# EAGLE schematic hot-wand (EAGLE 7.6.0)
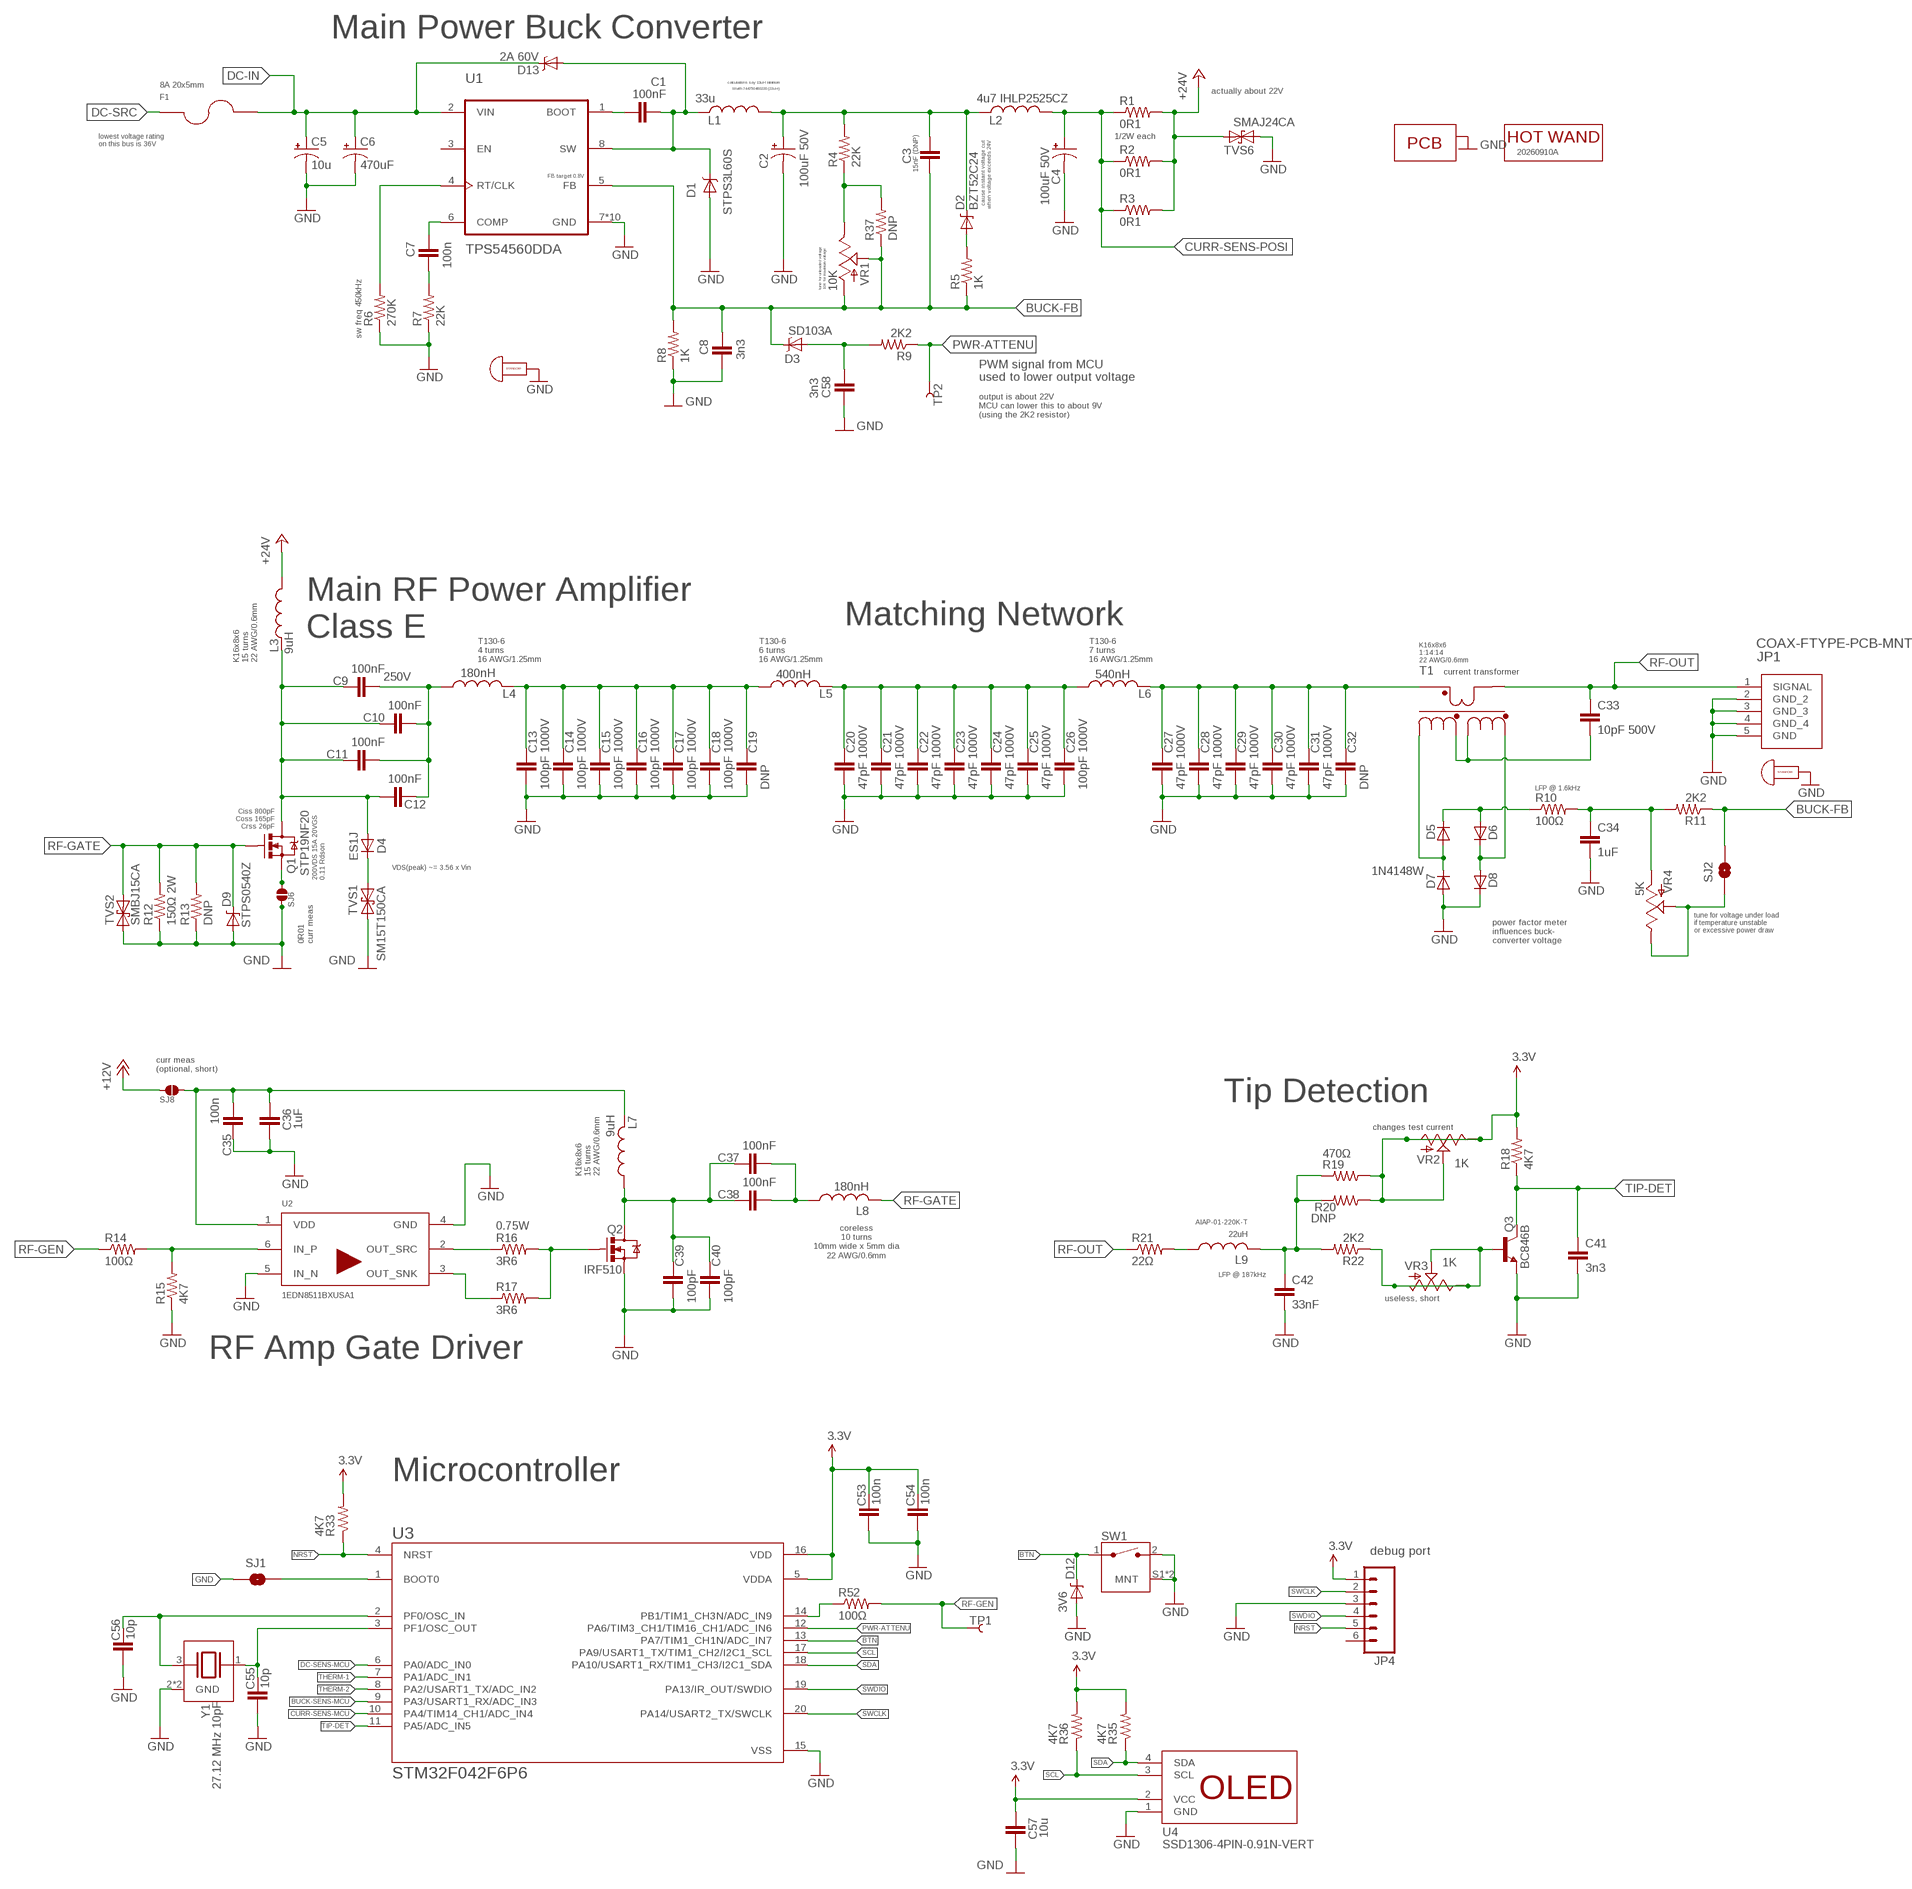
[diagram p0: schematic, sheet 1, part 1 of 2]
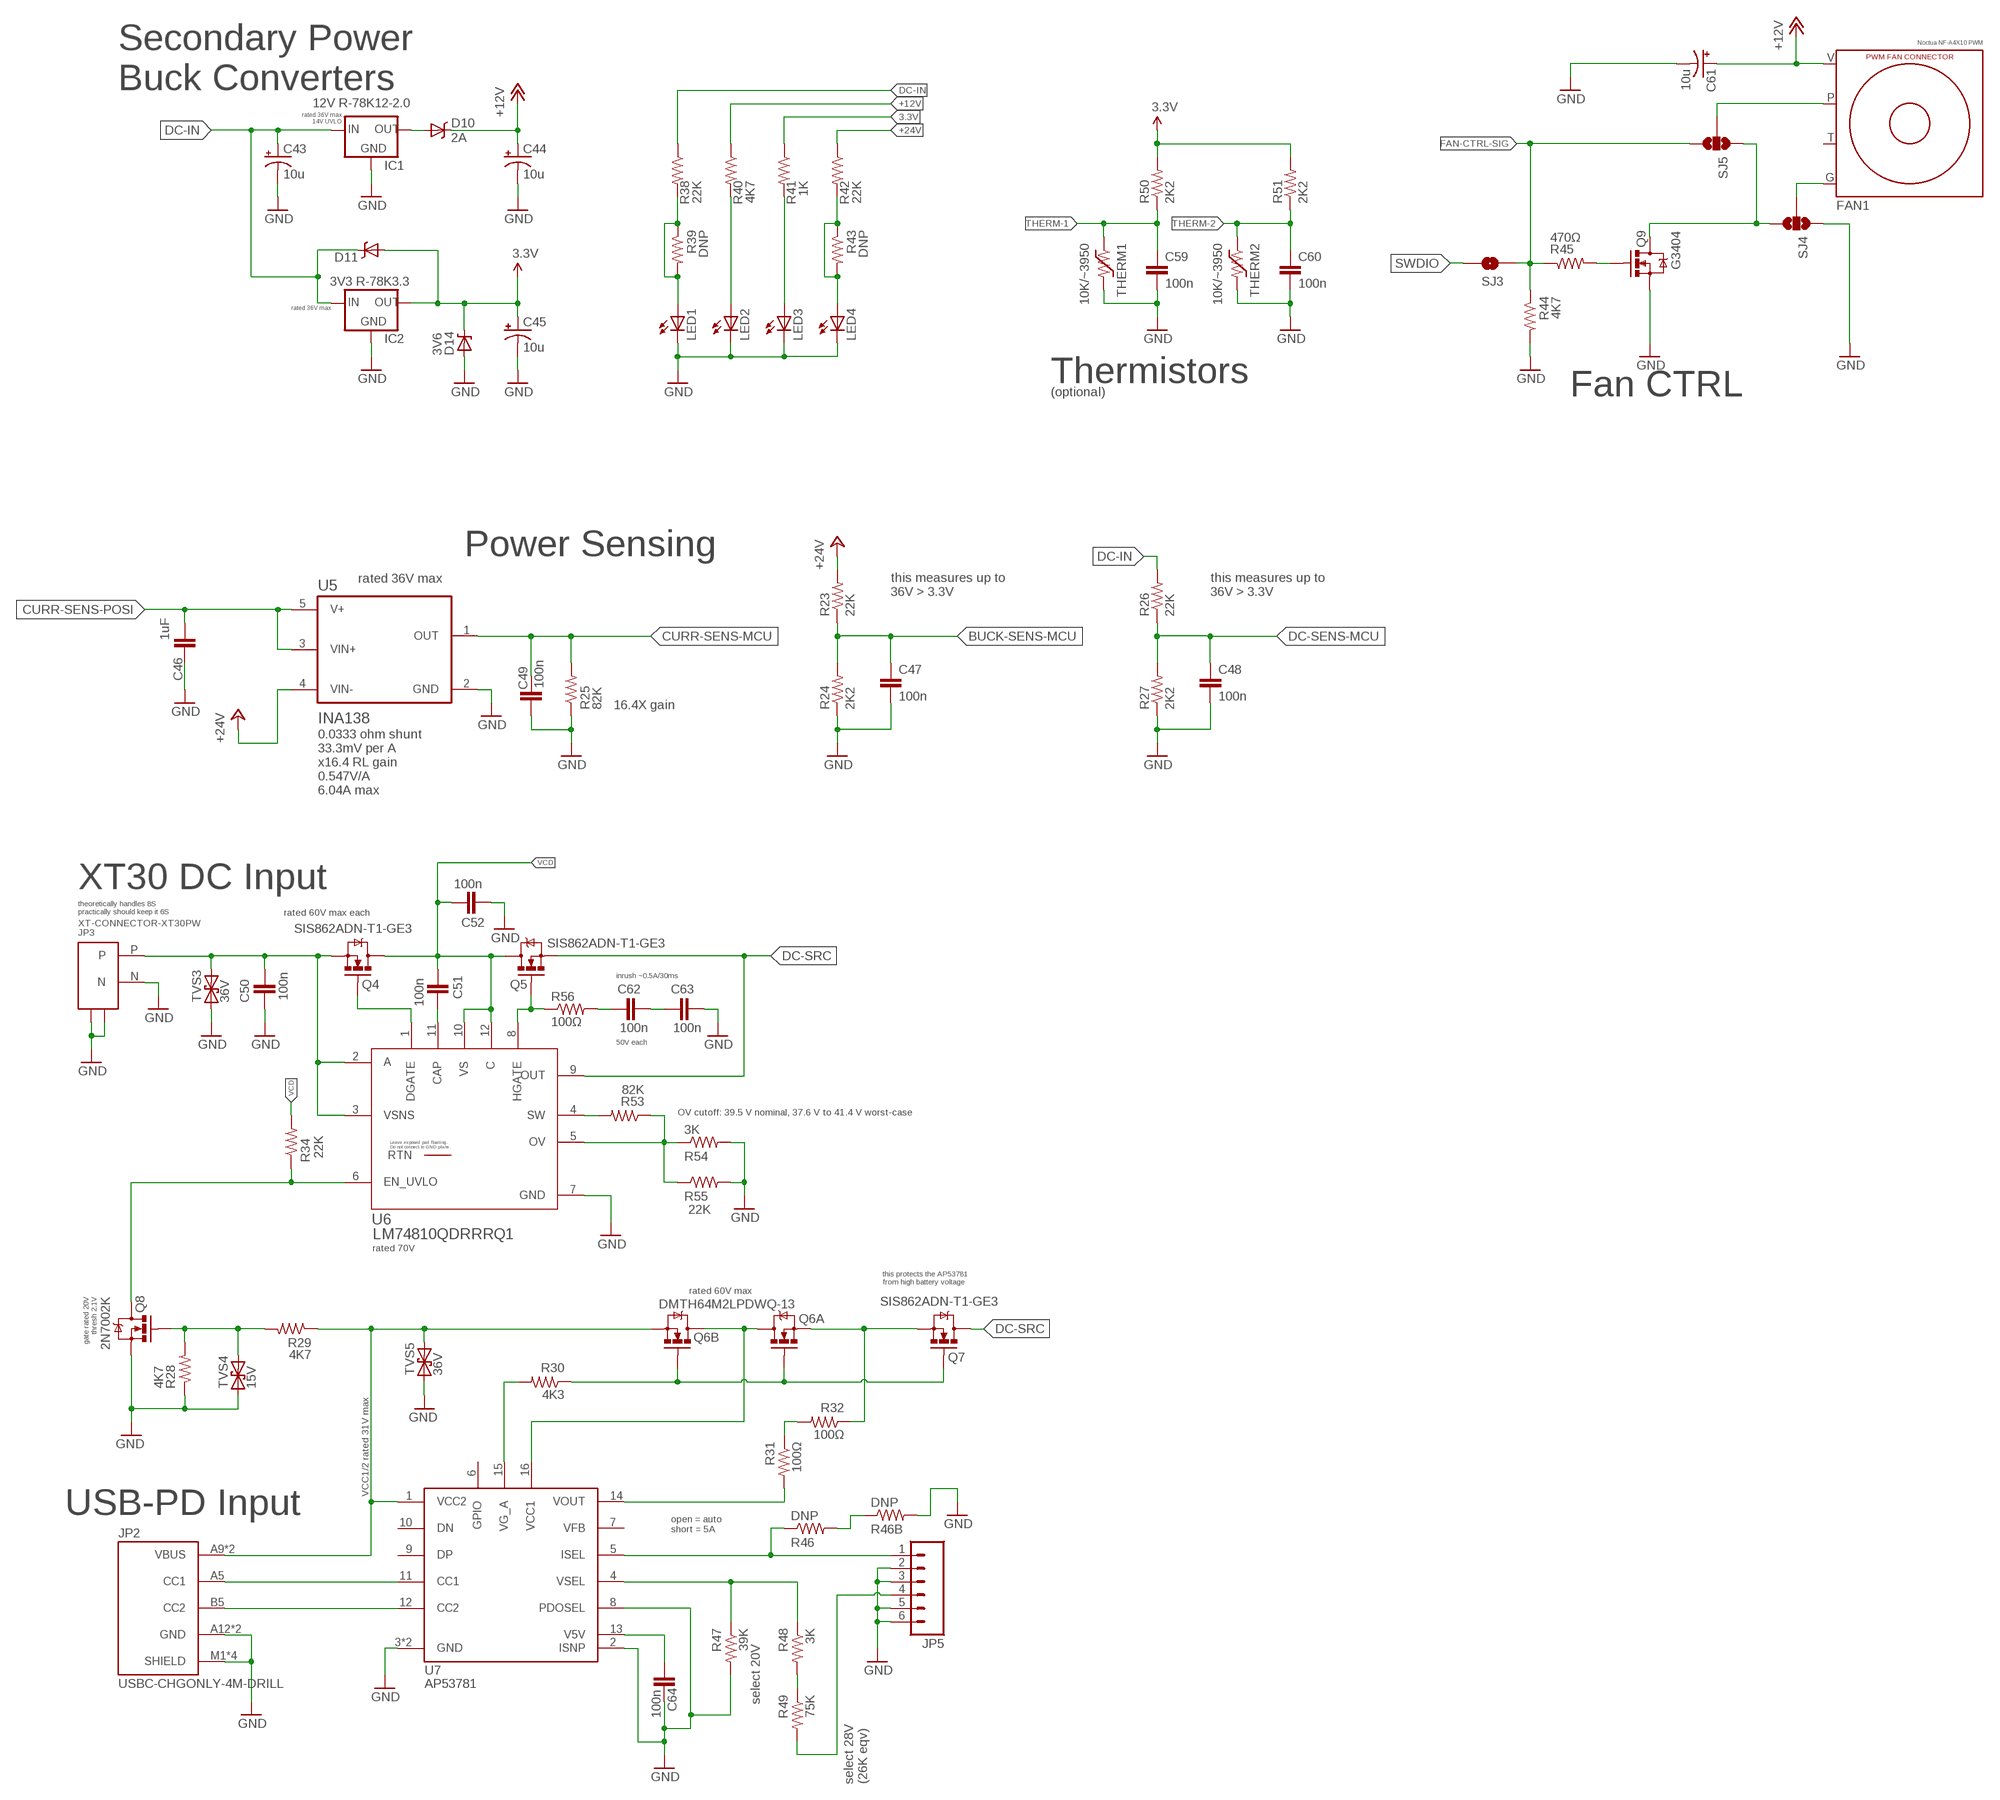
[diagram p1: schematic, sheet 1, part 2 of 2]

## Parts
C1  100nF  CAP0603-CAP  [0603-CAP]
C2  100uF 50V  CAP_POLPTH5  [CPOL-RADIAL-COMBO-10MM]
C3  15nF (DNP)  CAP0805  [0805]
C4  100uF 50V  CAP_POLPTH5  [CPOL-RADIAL-COMBO-10MM]
C5  10u  CAP_POL1206-KIT  [EIA3216-KIT]
C6  470uF  CAP_POLPTH4  [CPOL-RADIAL-1000UF-25V]
C7  100n  CAP0603-CAP  [0603-CAP]
C8  3n3  CAP0603-CAP  [0603-CAP]
C9  100nF  CAP0805-L  [0805-L]
C10  100nF  CAP0805-L  [0805-L]
C11  100nF  CAP0805-L  [0805-L]
C12  100nF  CAP0805-L  [0805-L]
C13  100pF 1000V  CAP0805-L  [0805-L]
C14  100pF 1000V  CAP0805-L  [0805-L]
C15  100pF 1000V  CAP0805-L  [0805-L]
C16  100pF 1000V  CAP0805-L  [0805-L]
C17  100pF 1000V  CAP0805-L  [0805-L]
C18  100pF 1000V  CAP0805-L  [0805-L]
C19  DNP  CAP0805-L  [0805-L]
C20  47pF 1000V  CAP0805-L  [0805-L]
C21  47pF 1000V  CAP0805-L  [0805-L]
C22  47pF 1000V  CAP0805-L  [0805-L]
C23  47pF 1000V  CAP0805-L  [0805-L]
C24  47pF 1000V  CAP0805-L  [0805-L]
C25  47pF 1000V  CAP0805-L  [0805-L]
C26  100pF 1000V  CAP0805-L  [0805-L]
C27  47pF 1000V  CAP0805-L  [0805-L]
C28  47pF 1000V  CAP0805-L  [0805-L]
C29  47pF 1000V  CAP0805-L  [0805-L]
C30  47pF 1000V  CAP0805-L  [0805-L]
C31  47pF 1000V  CAP0805-L  [0805-L]
C32  DNP  CAP0805-L  [0805-L]
C33  10pF 500V  CAP0805-L  [0805-L]
C34  1uF  CAP0603-CAP  [0603-CAP]
C35  100n  CAP0603-CAP  [0603-CAP]
C36  1uF  CAP0603-CAP  [0603-CAP]
C37  100nF  CAP0805-L  [0805-L]
C38  100nF  CAP0805-L  [0805-L]
C39  100pF  CAP0805-L  [0805-L]
C40  100pF  CAP0805-L  [0805-L]
C41  3n3  CAP0603-CAP  [0603-CAP]
C42  33nF  CAP0603-CAP  [0603-CAP]
C43  10u  CAP_POL1206-KIT  [EIA3216-KIT]
C44  10u  CAP_POL1206-KIT  [EIA3216-KIT]
C45  10u  CAP_POL1206  [EIA3216]
C46  1uF  CAP0603-CAP  [0603-CAP]
C47  100n  CAP0603-CAP  [0603-CAP]
C48  100n  CAP0603-CAP  [0603-CAP]
C49  100n  CAP0603-CAP  [0603-CAP]
C50  100n  CAP0603-CAP  [0603-CAP]
C51  100n  CAP0603-CAP  [0603-CAP]
C52  100n  CAP0603-CAP  [0603-CAP]
C53  100n  CAP0603-CAP  [0603-CAP]
C54  100n  CAP0603-CAP  [0603-CAP]
C55  10p  CAP0603-CAP  [0603-CAP]
C56  10p  CAP0603-CAP  [0603-CAP]
C57  10u  CAP1206  [1206]
C58  3n3  CAP0603-CAP  [0603-CAP]
C59  100n  CAP0603-CAP  [0603-CAP]
C60  100n  CAP0603-CAP  [0603-CAP]
C61  10u  CAP_POL1206-KIT  [EIA3216-KIT]
C62  100n  CAP0603-CAP  [0603-CAP]
C63  100n  CAP0603-CAP  [0603-CAP]
C64  100n  CAP0603-CAP  [0603-CAP]
D1  STPS3L60S  DIODE-SCHOTTKYSMC  [SMC]
D2  BZT52C24  DIODE-ZENERSOD123FL  [SOD123FL]
D3  SD103A  DIODE-SCHOTTKYSOD-323  [SOD-323]
D4  ES1J  DIODESMA  [SMA-DIODE]
D5  4148  DIODESOD123FL  [SOD123FL]
D6  4148  DIODESOD123FL  [SOD123FL]
D7  1N4148W  DIODESOD123FL  [SOD123FL]
D8  4148  DIODESOD123FL  [SOD123FL]
D9  STPS0540Z  DIODE-ZENERSOD123FL  [SOD123FL]
D10  2A  DIODE-SCHOTTKY_  [SMA-DIODE]
D11  DIODE-SCHOTTKY_  [SMA-DIODE]
D12  3V6  DIODE-ZENER-BZT52  [SOD-323]
D13  2A 60V  DIODE-SCHOTTKYSOD123FL  [SOD123FL]
D14  3V6  DIODE-ZENER-BZT52  [SOD-323]
F1  8A 20x5mm  FUSEX20MM  [FUSE_5MM]
FAN1  FAN-CONN-X4-CONN-X4  [FAN-CONN-X4]
IC1  12V R-78K12-2.0  V_REG_78XX-BUCK  [TO220-BUCK-12V]
IC2  3V3 R-78K3.3  V_REG_78XX-BUCK-3.3V  [TO220-BUCK-3.3V]
JP1  COAX-FTYPE-PCB-MNT  [CONN_73330-0030_MOL]
JP2  USBC-CHGONLY-4M-DRILL  [SAMESKY_UJC-H-G-SMT-2-P6-TR-DRILL]
JP3  XT-CONNECTOR-XT30PW  [XT30PW]
JP4  M06LOCK  [1X06_LOCK]
JP5  M06LOCK  [1X06_LOCK]
L1  33u  INDUCTORRADIAL_D12.7_COMBO  [IND_RADIAL_D12.7_COMBO]
L2  4u7 IHLP2525CZ  INDUCTORIHLP-2525CZ_VIS-M  [IND_IHLP-2525CZ_VIS-M]
L3  9uH  INDUCTOR-K16X8X6  [IND_K16X8X6_X2]
L4  180nH  INDUCTOR-T130-6  [IND_T130-6_X2]
L5  400nH  INDUCTOR-T130-6  [IND_T130-6_X2]
L6  540nH  INDUCTOR-T130-6  [IND_T130-6_X2]
L7  9uH  INDUCTOR-K16X8X6  [IND_K16X8X6_X2]
L8  180nH  L-USIND-10X6MM  [IND-10X6MM]
L9  22uH  L-USTFI0410  [TFI0410]
LED1  LED  LED0603  [LED-0603]
LED2  LED  LED0603  [LED-0603]
LED3  LED  LED0603  [LED-0603]
LED4  LED  LED0603  [LED-0603]
PCB1  PCB-OUTLINE  [PCB-OUTLINE]
PCB2  PCB-ART-VERSION  [PCB-ART-VERSION]
Q1  STP19NF20  MOSFET-NCHANNEL-TO220V-REAR  [TO220V-REAR]
Q2  IRF510  MOSFET-NCHANNEL-TO220V-REAR  [TO220V-REAR]
Q3  BC846B  TRANSISTOR_NPNSOT23-3  [SOT23-3]
Q4  SIS862ADN-T1-GE3  MOSFET-NCHANNEL-POWERPAK1212-8  [POWERPAK-1212-8]
Q5  SIS862ADN-T1-GE3  MOSFET-NCHANNEL-POWERPAK1212-8  [POWERPAK-1212-8]
Q6  DMTH64M2LPDWQ-13  MOSFET-NCHAN-X2-PPSO8X2  [POWERPAK-SO8-X2]
Q7  SIS862ADN-T1-GE3  MOSFET-NCHANNEL-POWERPAK1212-8  [POWERPAK-1212-8]
Q8  2N7002K  MOSFET-NCHANNELSMD  [SOT23-3]
Q9  G3404  MOSFET-NCHANNELSMD  [SOT23-3]
R1  0R1  RESISTOR1206  [1206]
R2  0R1  RESISTOR1206  [1206]
R3  0R1  RESISTOR1206  [1206]
R4  22K  RESISTOR0603-RES  [0603-RES]
R5  1K  RESISTOR0603-RES  [0603-RES]
R6  270K  RESISTOR0603-RES  [0603-RES]
R7  22K  RESISTOR0603-RES  [0603-RES]
R8  1K  RESISTOR0603-RES  [0603-RES]
R9  2K2  RESISTOR0603-RES  [0603-RES]
R10  100Ω  RESISTOR0603-RES  [0603-RES]
R11  2K2  RESISTOR0603-RES  [0603-RES]
R12  150Ω 2W  R-US_R2512  [R2512]
R13  DNP  R-US_R2512  [R2512]
R14  100Ω  RESISTOR0603-RES  [0603-RES]
R15  4K7  RESISTOR0603-RES  [0603-RES]
R16  3R6  RESISTOR1206  [1206]
R17  3R6  RESISTOR1206  [1206]
R18  4K7  RESISTOR0603-RES  [0603-RES]
R19  470Ω  RESISTOR0603-RES  [0603-RES]
R20  DNP  RESISTOR0805-RES  [0805]
R21  22Ω  RESISTOR2512  [R2512]
R22  2K2  RESISTOR0603-RES  [0603-RES]
R23  22K  RESISTOR0603-RES  [0603-RES]
R24  2K2  RESISTOR0603-RES  [0603-RES]
R25  82K  RESISTOR0603-RES  [0603-RES]
R26  22K  RESISTOR0603-RES  [0603-RES]
R27  2K2  RESISTOR0603-RES  [0603-RES]
R28  4K7  RESISTOR0603-RES  [0603-RES]
R29  4K7  RESISTOR0603-RES  [0603-RES]
R30  4K3  RESISTOR0603-RES  [0603-RES]
R31  100Ω  RESISTOR0805-RES  [0805]
R32  100Ω  RESISTOR0805-RES  [0805]
R33  4K7  RESISTOR0603-RES  [0603-RES]
R34  22K  RESISTOR0603-RES  [0603-RES]
R35  4K7  RESISTOR0603-RES  [0603-RES]
R36  4K7  RESISTOR0603-RES  [0603-RES]
R37  DNP  RESISTOR0603-RES  [0603-RES]
R38  22K  RESISTOR0603-RES  [0603-RES]
R39  DNP  RESISTOR0603-RES  [0603-RES]
R40  4K7  RESISTOR0603-RES  [0603-RES]
R41  1K  RESISTOR0603-RES  [0603-RES]
R42  22K  RESISTOR0603-RES  [0603-RES]
R43  DNP  RESISTOR0603-RES  [0603-RES]
R44  4K7  RESISTOR0603-RES  [0603-RES]
R45  470Ω  RESISTOR0603-RES  [0603-RES]
R46  DNP  RESISTOR0603-RES  [0603-RES]
R46B  DNP  RESISTOR0603-RES  [0603-RES]
R47  39K  RESISTOR0603-RES  [0603-RES]
R48  3K  RESISTOR0603-RES  [0603-RES]
R49  75K  RESISTOR0603-RES  [0603-RES]
R50  2K2  RESISTOR0603-RES  [0603-RES]
R51  2K2  RESISTOR0603-RES  [0603-RES]
R52  100Ω  RESISTOR0603-RES  [0603-RES]
R53  82K  RESISTOR0603-RES  [0603-RES]
R54  3K  RESISTOR0603-RES  [0603-RES]
R55  22K  RESISTOR0603-RES  [0603-RES]
R56  100Ω  RESISTOR0805-RES  [0805]
SJ1  SOLDERJUMPERNO  [SJ_2S-NO]
SJ2  SOLDERJUMPERNO  [SJ_2S-NO]
SJ3  SOLDERJUMPERNO  [SJ_2S-NO]
SJ4  SOLDERJUMPER_2WAYS  [SJ_3]
SJ5  SOLDERJUMPER_2WAYS  [SJ_3]
SJ6  SJ-SMALL-1206-SJ  [1206-SJ]
SJ7  SJ-SMALL-1206-SJ  [1206-SJ]
SJ8  SJ-SMALL-1206-SJ  [1206-SJ]
STANDOFF1  STANDOFF-M2.5-4.5MMHEX  [STANDOFF-M2.5-4.5MMHEX]
STANDOFF2  STANDOFF-M2.5-4.5MMHEX  [STANDOFF-M2.5-4.5MMHEX]
SW1  SW-TACT-SIDE  [SW_1-1825027-1]
T1  XFORMER-1:14:14  [XFORMER-K16X8X6-1:14:14]
THERM1  10K/~3950  THERMISTOR-NTC-TH-2MM  [1X02-2MM]
THERM2  10K/~3950  THERMISTOR-NTC-TH-2MM  [1X02-2MM]
TP1  TEST-POINT-SQ-2MM  [PAD-SQ-2MM]
TP2  TEST-POINT-SQ-2MM  [PAD-SQ-2MM]
TVS1  SM15T150CA  TVSSMC  [SMC]
TVS2  SMBJ15CA  TVS  [SMA-DIODE]
TVS3  36V  TVSSMA  [SMA]
TVS4  15V  TVSSOD-323  [SOD-323]
TVS5  36V  TVSSMA  [SMA]
TVS6  SMAJ24CA  TVSSMA  [SMA]
U1  TPS54560DDA  [VREG_LM5017MR/NOPB]
U2  1EDN8511BXUSA1  1EDN8511B  [SOT95P280X145-6N-7-V]
U3  STM32F042F6P6  STM32F030F4P6  [SOP65P640X120-20N]
U4  SSD1306-4PIN-0.91N-VERT  OLED-SSD1306-4PIN-0.91N-VERT  [OLED-0.91IN-VERT]
U5  INA138  INA138NA/3K  [SOT95P280X145-5N]
U6  LM74810QDRRRQ1  [DRR0012E-MFG]
U7  AP53781  AP53781-QFN3030-16  [QFN3030-16]
VR1  10K  POT-35WR1KLFTR_V2  [TRIM_35WR1KLFTR_V2]
VR2  1K  POT-35WR1KLFTR_V3  [TRIM_35WR1KLFTR_V3]
VR3  1K  POT-35WR1KLFTR_V3  [TRIM_35WR1KLFTR_V3]
VR4  5K  POT-35WR1KLFTR_V2  [TRIM_35WR1KLFTR_V2]
Y1  27.12 MHz 10pF  XTAL-4SMD-3.2X2.5-V2  [XTAL-4SMD-3.2X2.5-V2]

## Nets
3.3V: C45.A(+) C53.1 C54.1 C57.2 D11.A D14.1(C) IC2.3(OUT) JP4.1 R18.2 R19.1 R20.1 R33.2 R35.2 R36.2 R41.1 R50.2 R51.2 U3.5(VDDA) U3.16(VDD) U4.2(VCC) VR2.1(A) VR2.2(S) VR2.3(E)
12V-2: D10.A IC1.3(OUT)
12V-FOR-GATE-DRIVER: C35.2 C36.2 L7.2 SJ8.2 U2.1(VDD)
+12V: C44.A(+) C61.A(+) D10.C FAN1.V R40.1 SJ8.1
+24V: L3.2 R1.2 R2.2 R3.2 R23.2 R42.1 TVS6.C U5.4(VIN-)
BTN: D12.1(C) SW1.1 U3.13(PA7/TIM1_CH1N/ADC_IN7)
BUCK-1ST-STAGE: C2.1(+) C2.1B(+) C3.2 D2.C L1.2 L1.2B L2.1 R4.2
BUCK-FB: C3.1 C8.2 D3.1(C) R5.1 R8.2 R11.1 R37.1 SJ2.2 U1.5(FB) VR1.1(A) VR1.2(S)
BUCK-SENS-MCU: C47.1 R23.1 R24.2 U3.9(PA3/USART1_RX/ADC_IN3)
BUCK-SWITCH-NODE: C1.2 D1.C D13.A L1.1 L1.1B U1.8(SW)
CURR-SENS-MCU: C49.1 R25.2 U3.10(PA4/TIM14_CH1/ADC_IN4) U5.1(OUT)
CURR-SENS-POSI: C4.1(+) C4.1B(+) C46.2 L2.2 R1.1 R2.1 R3.1 U5.3(VIN+) U5.5(V+)
DC-IN: C5.A(+) C6.1(+) C43.A(+) D11.C D13.C F1.3 F1.4 IC1.1(IN) IC2.1(IN) R26.2 R38.1 U1.2(VIN)
DC-SENS-MCU: C48.1 R26.1 R27.2 U3.6(PA0/ADC_IN0)
DC-SRC: F1.1 F1.2 Q5.1(S) Q5.2(S) Q5.3(S) Q7.5(D) Q7.6(D) Q7.7(D) Q7.8(D) Q7.9(D) U6.9(OUT)
FAN-CTRL-SIG: R44.1 R45.1 SJ3.1 SJ5.3
GND: C2.2(-) C2.2B(-) C4.2(-) C4.2B(-) C5.C(-) C6.2(-) C8.1 C13.2 C14.2 C15.2 C16.2 C17.2 C18.2 C19.2 C20.2 C21.2 C22.2 C23.2 C24.2 C25.2 C26.2 C27.2 C28.2 C29.2 C30.2 C31.2 C32.2 C34.2 C35.1 C36.1 C39.2 C40.2 C41.2 C42.2 C43.C(-) C44.C(-) C45.C(-) C46.1 C47.2 C48.2 C49.2 C50.2 C52.2 C53.2 C54.2 C55.2 C56.2 C57.1 C58.1 C59.2 C60.2 C61.C(-) C63.1 C64.1 D1.A D7.A D8.C D9.A D12.2(A) D14.2(A) IC1.2(GND) IC2.2(GND) JP1.2(GND_2) JP1.3(GND_3) JP1.4(GND_4) JP1.5(GND) JP2.A12(GND) JP2.B12(GND) JP2.M1(SHIELD) JP2.M2(SHIELD) JP2.M3(SHIELD) JP2.M4(SHIELD) JP3.M1 JP3.M2 JP3.N JP4.3 JP5.2 JP5.3 JP5.5 JP5.6 LED1.C LED2.C LED3.C LED4.C PCB1.1 PCB1.2 PCB1.3 PCB1.4 Q2.3(S) Q3.2(E) Q8.2(S) Q9.2(S) R6.1 R7.1 R8.1 R12.1 R13.1 R15.1 R24.1 R25.1 R27.1 R28.1 R44.2 R46B.2 R47.2 R54.2 R55.2 SJ1.1 SJ4.1 SJ6.1 SJ7.1 STANDOFF1.1 STANDOFF1.2 STANDOFF2.1 STANDOFF2.2 SW1.2 SW1.S1(MNT) SW1.S2(MNT) THERM1.2 THERM2.2 TVS1.A TVS2.A TVS3.A TVS4.2 TVS5.A TVS6.A U1.7(GND) U1.9(GND) U1.10(GND) U1.11(GND) U1.12(GND) U1.13(GND) U1.14(GND) U1.15(GND) U1.16(GND) U1.17(GND) U2.4(GND) U2.5(IN_N) U3.15(VSS) U4.1(GND) U5.2(GND) U6.7(GND) U7.2(ISNP) U7.3(GND) U7.8(PDOSEL) U7.EXP(GND) Y1.2(GND) Y1.4(GND)
MCU-BOOT0: SJ1.2 U3.1(BOOT0)
MCU-OSC-IN: C56.1 U3.2(PF0/OSC_IN) Y1.3
MCU-OSC-OUT: C55.1 U3.3(PF1/OSC_OUT) Y1.1
MCU-RF: R14.2 R15.2 U2.6(IN_P)
N$1: L9.1 R21.2
N$2: C33.2 T1.S1B T1.S2A
N$3: C20.1 C21.1 C22.1 C23.1 C24.1 C25.1 C26.1 L5.2 L6.1
N$4: D5.C D6.A R10.1
N$5: D6.C D8.A T1.S2B
N$6: D5.A D7.C T1.S1A
N$7: D4.C TVS1.C
N$9: C42.1 L9.2 R19.2 R20.2 R22.2
N$10: C13.1 C14.1 C15.1 C16.1 C17.1 C18.1 C19.1 L4.2 L5.1
N$11: C9.2 C10.2 C11.2 C12.2 L4.1
N$14: R16.1 U2.2(OUT_SRC)
N$15: R17.1 U2.3(OUT_SNK)
N$16: Q2.1(G) R16.2 R17.2
N$17: C37.2 C38.2 L8.1
N$19: C7.2 U1.6(COMP)
N$20: C7.1 R7.2
N$21: R6.2 U1.4(RT/CLK)
N$22: C1.1 U1.1(BOOT)
N$25: R4.1 R37.2 VR1.3(E)
N$27: D2.A R5.2
N$28: C58.2 D3.2(A) R9.2
N$29: C62.1 C63.2
N$30: Q8.1(G) R28.2 R29.2 TVS4.1
N$35: Q6.5(B:D) Q6.6(B:D) Q6.7(A:D) Q6.8(A:D) Q6.9(B:D) Q6.10(A:D) U7.16(VCC1)
N$38: C64.2 U7.13(V5V)
N$40: R31.2 U7.14(VOUT)
N$43: C62.2 R56.2
N$47: LED2.A R40.2
N$48: LED3.A R41.2
N$49: LED1.A R38.2 R39.1 R39.2
N$50: SJ2.1 VR4.2(S) VR4.3(E)
N$53: Q9.1(G) R45.2
N$55: R46.2 R46B.1
N$57: R31.1 R32.2
N$60: R48.2 R49.1
N$61: JP5.4 R49.2
N$62: LED4.A R42.2 R43.1 R43.2
N$63: Q6.1(A:S) Q7.1(S) Q7.2(S) Q7.3(S) R32.1
N$65: FAN1.G SJ4.2
N$67: FAN1.P SJ5.2
N$68: R53.2 U6.4(SW)
NRST: JP4.5 R33.1 U3.4(NRST)
PWR-ATTENU: R9.1 TP2.1 U3.12(PA6/TIM3_CH1/TIM16_CH1/ADC_IN6)
Q1-VD: C9.1 C10.1 C11.1 C12.1 D4.A L3.1 Q1.2(D)
Q1-VS: Q1.3(S) SJ6.2 SJ7.2
Q2-VD: C37.1 C38.1 C39.1 C40.1 L7.1 Q2.2(D)
Q3-VB: Q3.1(B) R22.1 VR3.1(A) VR3.2(S) VR3.3(E)
Q9-VD: Q9.3(D) SJ4.3 SJ5.1
RF-FB-RECTIFIED: C34.1 R10.2 R11.2 VR4.1(A)
RF-FINAL: C27.1 C28.1 C29.1 C30.1 C31.1 C32.1 L6.2 T1.P1(P2)
RF-GATE: D9.C L8.2 Q1.1(G) R12.2 R13.2 TVS2.C
RF-GEN: R14.1 R52.2 TP1.1
RF-GEN-: R52.1 U3.14(PB1/TIM1_CH3N/ADC_IN9)
RF-OUT: C33.1 JP1.1(SIGNAL) R21.1 T1.P2(P1)
SCL: R36.1 U3.17(PA9/USART1_TX/TIM1_CH2/I2C1_SCL) U4.3(SCL)
SDA: R35.1 U3.18(PA10/USART1_RX/TIM1_CH3/I2C1_SDA) U4.4(SDA)
SWCLK: JP4.2 U3.20(PA14/USART2_TX/SWCLK)
SWDIO: JP4.4 SJ3.2 U3.19(PA13/IR_OUT/SWDIO)
THERM-1: C59.1 R50.1 THERM1.1 U3.7(PA1/ADC_IN1)
THERM-2: C60.1 R51.1 THERM2.1 U3.8(PA2/USART1_TX/ADC_IN2)
TIP-DET: C41.1 Q3.3(C) R18.1 U3.11(PA5/ADC_IN5)
U6-CAP: C51.1 U6.11(CAP)
U6-DGATE: Q4.4(G) U6.1(DGATE)
U6-EN: Q8.3(D) R34.1 U6.6(EN_UVLO)
U6-HGATE: Q5.4(G) R56.1 U6.8(HGATE)
U6-OV: R53.1 R54.1 R55.1 U6.5(OV)
U7-ISEL: JP5.1 R46.1 U7.5(ISEL)
U7-VGA: R30.2 U7.15(VG_A)
U7-VGA-2: Q6.2(A:G) Q6.4(B:G) Q7.4(G) R30.1
U7-VSEL: R47.1 R48.1 U7.4(VSEL)
USB-CC1: JP2.A5(CC1) U7.11(CC1)
USB-CC2: JP2.B5(CC2) U7.12(CC2)
USB-VBUS: JP2.A9(VBUS) JP2.B9(VBUS) Q6.3(B:S) R29.1 TVS5.C U7.1(VCC2)
VCD: C51.2 C52.1 Q4.5(D) Q4.6(D) Q4.7(D) Q4.8(D) Q4.9(D) Q5.5(D) Q5.6(D) Q5.7(D) Q5.8(D) Q5.9(D) R34.2 U6.10(VS) U6.12(C)
VIN-XT30: C50.1 JP3.P Q4.1(S) Q4.2(S) Q4.3(S) TVS3.C U6.2(A) U6.3(VSNS)
Unconnected: FAN1.T JP4.6 U1.3(EN) U6.13(RTN) U7.6(GPIO) U7.7(VFB) U7.9(DP) U7.10(DN)

## Notes on the sheet
- Main Power Buck Converter
- calculations say 13uH minimum
- actually about 22V
- Wurth 744750460220 (22uH)
- 1/2W each
- cause instant voltage cut
  when voltage exceeds 24V
- lowest voltage rating
  on this bus is 36V
- FB target 0.8V
- tune for unloaded voltage
  10K for maximum voltage
- sw freq 450kHz
- PWM signal from MCU
  used to lower output voltage
- output is about 22V
  MCU can lower this to about 9V
  (using the 2K2 resistor)
- Main RF Power Amplifier
  Class E
- Matching Network
- K16x8x6
  15 turns
  22 AWG/0.6mm
- T130-6
  4 turns
  16 AWG/1.25mm
- T130-6
  6 turns
  16 AWG/1.25mm
- T130-6
  7 turns
  16 AWG/1.25mm
- K16x8x6
  1:14:14
  22 AWG/0.6mm
- current transformer
- 250V
- LFP @ 1.6kHz
- Ciss 800pF
  Coss 165pF
  Crss 26pF
- VDS(peak) ~= 3.56 x Vin
- 200VDS 15A 20VGS
  0.11 Rdson
- tune for voltage under load
  if temperature unstable
  or excessive power draw
- power factor meter
  influences buck-
  converter voltage
- 0R01
  curr meas
- curr meas
  (optional, short)
- Tip Detection
- changes test current
- K16x8x6
  15 turns
  22 AWG/0.6mm
- coreless
  10 turns
  10mm wide x 5mm dia
  22 AWG/0.6mm
- AIAP-01-220K-T
- 0.75W
- LFP @ 187kHz
- useless, short
- RF Amp Gate Driver
- Microcontroller
- debug port
- Noctua NF-A4X10 PWM
- Secondary Power
  Buck Converters
- rated 36V max
  14V UVLO
- rated 36V max
- Thermistors
- (optional) | Fan CTRL
- Power Sensing
- rated 36V max
- this measures up to
  36V > 3.3V
- this measures up to
  36V > 3.3V
- 16.4X gain
- 0.0333 ohm shunt
  33.3mV per A
  x16.4 RL gain
  0.547V/A
  6.04A max
- XT30 DC Input
- theoretically handles 8S
  practically should keep it 6S
- rated 60V max each
- inrush ~0.5A/30ms
- 50V each
- OV cutoff: 39.5 V nominal, 37.6 V to 41.4 V worst-case
- rated 70V
- this protects the AP53781
  from high battery voltage
- rated 60V max
- gate rated 20V
  thresh 2.1V
- VCC1/2 rated 31V max
- USB-PD Input
- open = auto
  short = 5A
- select 20V
- select 28V
  (26K eqv)

## Library data of the parts
C1 C7 C35 C48-C54 C59 C60 C62-C64 = hot-wand:CAP: Capacitor Standard 0603 ceramic capacitor, and 0.1" leaded capacitor.; JLCPARTNUM: C14663
C2 = hot-wand:CAP_POL: Capacitor Polarized These are standard SMD and PTH capacitors. Normally 10uF, 47uF, and 100uF in electrolytic and tantalum varieties. Always verify the external diameter of the through hole cap, it varies with capacity, voltage, and manufacturer. The EIA devices should be standard.; JLC-DNP: 1; PARTNUM: EEU-FR1H101B;EEU-FR1J101B
C3 = hot-wand:CAP: Capacitor Standard 0603 ceramic capacitor, and 0.1" leaded capacitor.; DNP: 1; JLC-DNP: 1
C4 = hot-wand:CAP_POL: Capacitor Polarized These are standard SMD and PTH capacitors. Normally 10uF, 47uF, and 100uF in electrolytic and tantalum varieties. Always verify the external diameter of the through hole cap, it varies with capacity, voltage, and manufacturer. The EIA devices should be standard.; JLC-DNP: 1
C5 C43 C61 = hot-wand:CAP_POL: Capacitor Polarized These are standard SMD and PTH capacitors. Normally 10uF, 47uF, and 100uF in electrolytic and tantalum varieties. Always verify the external diameter of the through hole cap, it varies with capacity, voltage, and manufacturer. The EIA devices should be standard.; JLCPARTNUM: C13585; PARTNUM: MLASU31LBB5106KTNA01;GRT31CR61H106KE01K
C6 = hot-wand:CAP_POL: Capacitor Polarized These are standard SMD and PTH capacitors. Normally 10uF, 47uF, and 100uF in electrolytic and tantalum varieties. Always verify the external diameter of the through hole cap, it varies with capacity, voltage, and manufacturer. The EIA devices should be standard.; JLC-DNP: 1; PARTNUM: UHW1H471MPD;EEU-FR1H471;EEU-FR1H471B
C8 C41 C58 = hot-wand:CAP: Capacitor Standard 0603 ceramic capacitor, and 0.1" leaded capacitor.; JLCPARTNUM: C1613
C9-C12 C37 C38 = hot-wand:CAP: Capacitor Standard 0603 ceramic capacitor, and 0.1" leaded capacitor.; JLCPARTNUM: C5182461; PARTNUM: CHV0805N250104KXT;MBASQ21GAB7104KTCA01;MBASQ21GAB7104MTCA01
C13 = hot-wand:CAP: Capacitor Standard 0603 ceramic capacitor, and 0.1" leaded capacitor.; JLCPARTNUM: C6958299; PARTNUM: QCCT102Q101J1GV001E; PLACEHOLDERPART: C28233
C14-C18 C26 C39 C40 = hot-wand:CAP: Capacitor Standard 0603 ceramic capacitor, and 0.1" leaded capacitor.; JLCPARTNUM: C6958299
C19 = hot-wand:CAP: Capacitor Standard 0603 ceramic capacitor, and 0.1" leaded capacitor.; DNP: 1; JLCPARTNUM: C6958299
C20 = hot-wand:CAP: Capacitor Standard 0603 ceramic capacitor, and 0.1" leaded capacitor.; JLCPARTNUM: C6366545; PARTNUM: QCCT102Q470J1GV001E
C21-C25 C27-C31 = hot-wand:CAP: Capacitor Standard 0603 ceramic capacitor, and 0.1" leaded capacitor.; JLCPARTNUM: C6366545
C32 = hot-wand:CAP: Capacitor Standard 0603 ceramic capacitor, and 0.1" leaded capacitor.; JLC-DNP: 1
C33 = hot-wand:CAP: Capacitor Standard 0603 ceramic capacitor, and 0.1" leaded capacitor.; JLCPARTNUM: C6629873; PARTNUM: QCCT102Q100J1GV001E
C34 C36 C46 = hot-wand:CAP: Capacitor Standard 0603 ceramic capacitor, and 0.1" leaded capacitor.; JLCPARTNUM: C15849
C42 = hot-wand:CAP: Capacitor Standard 0603 ceramic capacitor, and 0.1" leaded capacitor.; JLCPARTNUM: C21117
C44 C45 = hot-wand:CAP_POL: Capacitor Polarized These are standard SMD and PTH capacitors. Normally 10uF, 47uF, and 100uF in electrolytic and tantalum varieties. Always verify the external diameter of the through hole cap, it varies with capacity, voltage, and manufacturer. The EIA devices should be standard.; JLCPARTNUM: C13585; PARTNUM: TAJA106K016TNJ;T491A106K016AT
C47 = hot-wand:CAP: Capacitor Standard 0603 ceramic capacitor, and 0.1" leaded capacitor.
C55 C56 = hot-wand:CAP: Capacitor Standard 0603 ceramic capacitor, and 0.1" leaded capacitor.; JLCPARTNUM: C1634
C57 = hot-wand:CAP: Capacitor Standard 0603 ceramic capacitor, and 0.1" leaded capacitor.; JLCPARTNUM: C13585
D1 = hot-wand:DIODE-SCHOTTKY; JLCPARTNUM: C2971007
D2 = hot-wand:DIODE-ZENER: Zener Diode Production Part - 8199 3.4V Zener Voltage; JLCPARTNUM: C2109
D3 = hot-wand:DIODE-SCHOTTKY; JLCPARTNUM: C7420360
D4 = hot-wand:DIODE: Diode These are standard reverse protection diodes and small signal diodes. SMA package can handle up to about 1A. SOD-323 can handle about 200mA. What the SOD-323 package when ordering, there are some mfgs out there that are 5-pin packages.; JLCPARTNUM: C64879; JLC_ROTATION: 180
D5-D8 = hot-wand:DIODE: Diode These are standard reverse protection diodes and small signal diodes. SMA package can handle up to about 1A. SOD-323 can handle about 200mA. What the SOD-323 package when ordering, there are some mfgs out there that are 5-pin packages.; JLCPARTNUM: C84367
D9 = hot-wand:DIODE-ZENER: Zener Diode Production Part - 8199 3.4V Zener Voltage; JLCPARTNUM: C181835
D10 = hot-wand:DIODE-SCHOTTKY; JLCPARTNUM: C698873; JLC_ROTATION: 180; PARTNUM: VSSAF5N50;SL36A
D11 = hot-wand:DIODE-SCHOTTKY; JLCPARTNUM: C698873; JLC_ROTATION: 180
D12 D14 = hot-wand:DIODE-ZENER: Zener Diode Production Part - 8199 3.4V Zener Voltage; JLCPARTNUM: C840638; PARTNUM: ESDLC3V3D3B-TP;CDSOD323-T03SC;SD03LCC
D13 = hot-wand:DIODE-SCHOTTKY; JLCPARTNUM: C53340922; PARTNUM: STPS2L60ZFY
F1 = hot-wand:FUSE; JLC-DNP: 1; PARTNUM: Keystone 3518P
FAN1 = hot-wand:FAN-CONN-X4
IC1 IC2 = hot-wand:V_REG_78XX: Voltage Regulator Standard 7805 5V regulator. IGO (Input Ground Output). Spark Fun Electronics SKU : COM-00107; JLC-DNP: 1
JP1 = hot-wand:COAX-FTYPE-PCB-MNT; CHECK_PRICES: https://www.snapeda.com/parts/733300030/Molex/view-part/?ref=eda; DESCRIPTION: F Type Connector Receptacle, Female Socket 75 Ohms Through Hole, Right Angle Solder; DIGIKEY_PART_NUMBER: WM5387-ND; JLC-DNP: 1; MF: Molex; MP: 733300030; PACKAGE: None; SNAPEDA_LINK: https://www.snapeda.com/parts/733300030/Molex/view-part/?ref=snap
JP2 = hot-wand:USBC-CHGONLY-4M; CHECK_PRICES: https://www.snapeda.com/parts/UJC-H-G-SMT-2-P6-TR/Same+Sky/view-part/?ref=eda; DESCRIPTION: Type C, Power Only, 30 Vac, 3 A, Horizontal, Gold plated 1u, Surface Mount,6 pin, USB Receptacle; DIGIKEY_PART_NUMBER: 2223-UJC-H-G-SMT-2-P6-TRCT-ND; JLC-DNP: 1; MF: Same Sky; MP: UJC-H-G-SMT-2-P6-TR; PACKAGE: None; SNAPEDA_LINK: https://www.snapeda.com/parts/UJC-H-G-SMT-2-P6-TR/Same+Sky/view-part/?ref=snap
JP3 = hot-wand:XT-CONNECTOR; JLC-DNP: 1
JP4 = hot-wand:M06: Header 6 Standard 6-pin 0.1" header. Use with straight break away headers (SKU : PRT-00116), right angle break away headers (PRT-00553), swiss pins (PRT-00743), machine pins (PRT-00117), and female headers (PRT-00115). Molex polarized connector foot print use with SKU : PRT-08094 with associated crimp pins and housings. NOTES ON THE VARIANTS LOCK and LOCK_LONGPADS... This footprint was designed to help hold the alignment of a through-hole component (i.e. 6-pin header) while soldering it into place. You may notice that each hole has been shifted either up or down by 0.005 of an inch from it's more standard position (which is a perfectly straight line). This slight alteration caused the pins (the squares in the middle) to touch the edges of the holes. Because they are alternating, it causes a "brace" to hold the component in place. 0.005 has proven to be the perfect amount of "off-center" position when using our standard breakaway headers. Although looks a little odd when you look at the bare footprint, once you have a header in there, the alteration is very hard to notice. Also, if you push a header all the way into place, it is covered up entirely on the bottom side. This idea of altering the position of holes to aid alignment will be further integrated into the Sparkfun Library for other footprints. It can help hold any component with 3 or more connection pins.; JLC-DNP: 1
JP5 = hot-wand:M06: Header 6 Standard 6-pin 0.1" header. Use with straight break away headers (SKU : PRT-00116), right angle break away headers (PRT-00553), swiss pins (PRT-00743), machine pins (PRT-00117), and female headers (PRT-00115). Molex polarized connector foot print use with SKU : PRT-08094 with associated crimp pins and housings. NOTES ON THE VARIANTS LOCK and LOCK_LONGPADS... This footprint was designed to help hold the alignment of a through-hole component (i.e. 6-pin header) while soldering it into place. You may notice that each hole has been shifted either up or down by 0.005 of an inch from it's more standard position (which is a perfectly straight line). This slight alteration caused the pins (the squares in the middle) to touch the edges of the holes. Because they are alternating, it causes a "brace" to hold the component in place. 0.005 has proven to be the perfect amount of "off-center" position when using our standard breakaway headers. Although looks a little odd when you look at the bare footprint, once you have a header in there, the alteration is very hard to notice. Also, if you push a header all the way into place, it is covered up entirely on the bottom side. This idea of altering the position of holes to aid alignment will be further integrated into the Sparkfun Library for other footprints. It can help hold any component with 3 or more connection pins.
L1 = hot-wand:INDUCTOR: Inductors Basic Inductor/Choke - 0603 and 1206. Footprints are not proven and vary greatly between part numbers.; JLC-DNP: 1; NOTE: 22 µH fitted; 33 µH original/preferred; 13 µH calculated minimum; PARTNUM: Wurth 744750460220 (22uH)
L2 = hot-wand:INDUCTOR: Inductors Basic Inductor/Choke - 0603 and 1206. Footprints are not proven and vary greatly between part numbers.; JLCPARTNUM: C845027; PARTNUM: IHLP2525CZER4R7M11
L3-L7 = hot-wand:INDUCTOR: Inductors Basic Inductor/Choke - 0603 and 1206. Footprints are not proven and vary greatly between part numbers.; JLC-DNP: 1
L8 = hot-wand:L-US: INDUCTOR, American symbol; JLC-DNP: 1
L9 = hot-wand:L-US: INDUCTOR, American symbol; JLC-DNP: 1; PARTNUM: AIAP-01-220K-T
LED1-LED4 = hot-wand:LED: LEDs Standard schematic elements and footprints for 5mm, 3mm, 1206, and 0603 sized LEDs. 5mm - Spark Fun Electronics SKU : COM-00529 (and others); JLC-DNP: 1
PCB1 = hot-wand:PCB-OUTLINE; JLC-DNP: 1
PCB2 = hot-wand:PCB-ART-VERSION; JLC-DNP: 1
Q1 Q2 Q4 Q5 Q7 = hot-wand:MOSFET-NCHANNEL; JLC-DNP: 1
Q3 = hot-wand:TRANSISTOR_NPN: Transistor NPN BJT configuration in SOT23 package. MMBT2222 is the common NPN we use. Double check BCE configuration again layout.; JLCPARTNUM: C181138
Q6 = hot-wand:MOSFET-NCHAN-X2; JLC-DNP: 1
Q8 = hot-wand:MOSFET-NCHANNEL; JLCPARTNUM: C14498;C547263;C5224211;C54347659; PARTNUM: 2N7002K;SSM3K388R,LF;Si2318CDS-T1-GE3;PMV60ENEAR
Q9 = hot-wand:MOSFET-NCHANNEL; JLCPARTNUM: C14498;C547263;C96615; PARTNUM: G3404;MMFTN3404A;PJA3404A;Si2318CDS-T1-GE3;PMV60ENEAR
R1-R3 = hot-wand:RESISTOR: Resistor Basic schematic elements and footprints for 0603, 1206, and PTH resistors.; JLCPARTNUM: C188071; PARTNUM: KDV12DR100ET;VMK-R033-1.0-U
R4 R7 R23 R26 R34 R38 R42 R55 = hot-wand:RESISTOR: Resistor Basic schematic elements and footprints for 0603, 1206, and PTH resistors.; JLCPARTNUM: C31850
R5 R8 R41 = hot-wand:RESISTOR: Resistor Basic schematic elements and footprints for 0603, 1206, and PTH resistors.; JLCPARTNUM: C21190
R6 = hot-wand:RESISTOR: Resistor Basic schematic elements and footprints for 0603, 1206, and PTH resistors.; JLCPARTNUM: C137755
R9 R11 R22 R24 R27 R50 R51 = hot-wand:RESISTOR: Resistor Basic schematic elements and footprints for 0603, 1206, and PTH resistors.; JLCPARTNUM: C4190
R10 R14 R52 = hot-wand:RESISTOR: Resistor Basic schematic elements and footprints for 0603, 1206, and PTH resistors.; JLCPARTNUM: C22775
R12 = hot-wand:R-US_: RESISTOR, American symbol; JLCPARTNUM: C175287; PARTNUM: CRGP2512F150R
R13 = hot-wand:R-US_: RESISTOR, American symbol; JLC-DNP: 1; PARTNUM: CRGP2512F150R
R15 R18 R28 R29 R33 R35 R36 R40 R44 = hot-wand:RESISTOR: Resistor Basic schematic elements and footprints for 0603, 1206, and PTH resistors.; JLCPARTNUM: C23162
R16 R17 = hot-wand:RESISTOR: Resistor Basic schematic elements and footprints for 0603, 1206, and PTH resistors.; JLCPARTNUM: C6301221
R19 R45 = hot-wand:RESISTOR: Resistor Basic schematic elements and footprints for 0603, 1206, and PTH resistors.; JLCPARTNUM: C23179
R20 R37 R46 R46B = hot-wand:RESISTOR: Resistor Basic schematic elements and footprints for 0603, 1206, and PTH resistors.; JLC-DNP: 1
R21 = hot-wand:RESISTOR: Resistor Basic schematic elements and footprints for 0603, 1206, and PTH resistors.; JLCPARTNUM: C5204054
R25 R53 = hot-wand:RESISTOR: Resistor Basic schematic elements and footprints for 0603, 1206, and PTH resistors.; JLCPARTNUM: C23254
R30 = hot-wand:RESISTOR: Resistor Basic schematic elements and footprints for 0603, 1206, and PTH resistors.; JLCPARTNUM: C23159
R31 R32 R56 = hot-wand:RESISTOR: Resistor Basic schematic elements and footprints for 0603, 1206, and PTH resistors.; JLCPARTNUM: C441975
R39 R43 = hot-wand:RESISTOR: Resistor Basic schematic elements and footprints for 0603, 1206, and PTH resistors.; DNP: 1
R47 = hot-wand:RESISTOR: Resistor Basic schematic elements and footprints for 0603, 1206, and PTH resistors.; JLCPARTNUM: C23153
R48 R54 = hot-wand:RESISTOR: Resistor Basic schematic elements and footprints for 0603, 1206, and PTH resistors.; JLCPARTNUM: C4211
R49 = hot-wand:RESISTOR: Resistor Basic schematic elements and footprints for 0603, 1206, and PTH resistors.; JLCPARTNUM: C23242
SJ1-SJ3 = hot-wand:SOLDERJUMPER: Solder Jumper Standard SMD solder jumper. Used to automate production. Two varients : Normally Open and Normally Closed are the same, but have different paste layers. NC will have a large amount of paste and should jumper during reflow.; JLC-DNP: 1
SJ4 SJ5 = hot-wand:SOLDERJUMPER_2WAY: Solder Jumper 2 way solder jumper
SJ6-SJ8 = hot-wand:SJ-SMALL
STANDOFF1 STANDOFF2 = hot-wand:STANDOFF
SW1 = hot-wand:SW-TACT-SIDE; CHECK_PRICES: https://www.snapeda.com/parts/1-1825027-1/TE+Connectivity+Alcoswitch+Switches/view-part/?ref=eda; COMMENT: 1-1825027-1; DESCRIPTION: FSMRA4JH04=R/A,TACT PB SW,160G SPST-NO; DIGIKEY_PART_NUMBER: 450-1658-ND; EU_ROHS_COMPLIANCE: Compliant; JLC-DNP: 1; MF: TE Connectivity; MP: 1-1825027-1; PACKAGE: None; PARTNUM: MJTP1236D;TL1105JAF160R1RBLK; SNAPEDA_LINK: https://www.snapeda.com/parts/1-1825027-1/TE+Connectivity+Alcoswitch+Switches/view-part/?ref=snap
T1 = hot-wand:XFORMER-1:14:14; JLC-DNP: 1
THERM1 THERM2 = hot-wand:THERMISTOR-NTC: Resistor Basic schematic elements and footprints for 0603, 1206, and PTH resistors.; JLC-DNP: 1; PARTNUM: B57891M0103K000
TP1 TP2 = hot-wand:TEST-POINT
TVS1 = hot-wand:TVS; JLCPARTNUM: C133715
TVS2 = hot-wand:TVS; JLCPARTNUM: C78809
TVS3 TVS5 = hot-wand:TVS; JLCPARTNUM: C134984; PARTNUM: SMAJ36CA
TVS4 = hot-wand:TVS; JLCPARTNUM: C2987151; PARTNUM: SD15C-01FTG;CDSOD323-T15SC;TSD15CDYFR
TVS6 = hot-wand:TVS; JLCPARTNUM: C148223
U1 = hot-wand:TPS54560DDA: Check availability <https://pricing.snapeda.com/parts/TPS54560DDA/Texas%20Instruments/view-part?ref=eda>; AVAILABILITY: In Stock; CHECK_PRICES: https://www.snapeda.com/parts/TPS54560DDA/Texas+Instruments/view-part/?ref=eda; DESCRIPTION: 4.5V to 60 V input, 5 A step-down converter with Eco-Mode; JLCPARTNUM: C31966; JLC_ROTATION: 270; MF: Texas Instruments; MP: TPS54560DDA; PACKAGE: HSOIC-8 Texas Instruments; PRICE: None; SNAPEDA_LINK: https://www.snapeda.com/parts/TPS54560DDA/Texas+Instruments/view-part/?ref=snap
U2 = hot-wand:1EDN8511B: 1EDN8511B SOT95P280X145-6N-7-V EiceDRIVER, Fast Single Channel 4A/8A Low-Side Gate Driver, UVLO - 8V; JLCPARTNUM: C3655509; JLC_ROTATION: 180
U3 = hot-wand:STM32F030F4P6: Check availability <https://pricing.snapeda.com/parts/STM32F030F4P6/STMicroelectronics/view-part?ref=eda>; JLCPARTNUM: C2969989; JLC_ROTATION: 180
U4 = hot-wand:OLED-SSD1306-4PIN; JLC-DNP: 1
U5 = hot-wand:INA138NA/3K: Check availability <https://pricing.snapeda.com/parts/INA138NA/3K/Texas%20Instruments/view-part?ref=eda>; AVAILABILITY: In Stock; CHECK_PRICES: https://www.snapeda.com/parts/INA138NA/3K/Texas+Instruments/view-part/?ref=eda; DESCRIPTION: 2.7 to 36V, 800kHz Variable gain current sense amplifier; JLCPARTNUM: C47914; JLC_ROTATION: 180; MF: Texas Instruments; MP: INA138NA/3K; PACKAGE: SOT-23-5 Texas Instruments; PRICE: None; SNAPEDA_LINK: https://www.snapeda.com/parts/INA138NA/3K/Texas+Instruments/view-part/?ref=snap
U6 = hot-wand:LM74810QDRRRQ1; COPYRIGHT: Copyright (C) 2026 Ultra Librarian. All rights reserved.; DATASHEET: https://www.ti.com/lit/gpn/lm7481-q1; DESCRIPTION: Automotive ideal diode controller with active rectification driving B2B NFETs 12-WSON -40 to 125; JLCPARTNUM: C3215601; MANUFACTURER_NAME: Texas Instruments; MANUFACTURER_PART_NUMBER: LM74810QDRRRQ1; REFDES: RefDes; TYPE: TYPE
U7 = hot-wand:AP53781; JLCPARTNUM: C52730979; JLC_ROTATION: 270
VR1 = hot-wand:POT; JLC-DNP: 1; PARTNUM: TC33X-2-103E
VR2 VR3 = hot-wand:POT; JLC-DNP: 1; PARTNUM: TC33X-2-102E
VR4 = hot-wand:POT; JLC-DNP: 1; PARTNUM: TC33X-2-502
Y1 = hot-wand:XTAL-4SMD: Check availability <https://pricing.snapeda.com/parts/ABM8-27.120MHZ-10-D1G-T/Abracon%20LLC/view-part?ref=eda>; AVAILABILITY: In Stock; CHECK_PRICES: https://www.snapeda.com/parts/ABM8-27.120MHZ-10-D1G-T/Abracon/view-part/?ref=eda; DESCRIPTION: 27.12 MHz ±10ppm Crystal 10pF 50 Ohms 4-SMD, No Lead; JLCPARTNUM: C1986817; JLC_ROTATION: 270; MF: Abracon LLC; MP: ABM8-27.120MHZ-10-D1G-T; PACKAGE: NON-STANDARD-4 ABRACON; PRICE: None; SNAPEDA_LINK: https://www.snapeda.com/parts/ABM8-27.120MHZ-10-D1G-T/Abracon/view-part/?ref=snap